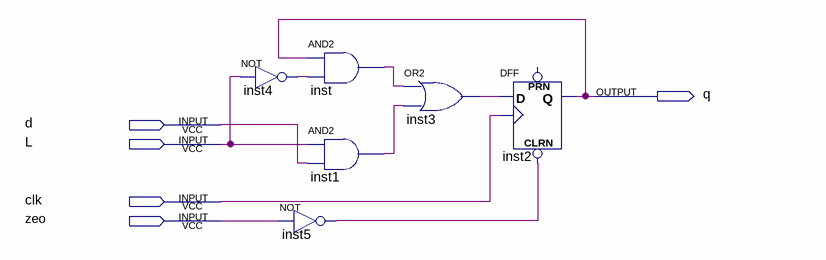
[diagram p0: schematic sheet]
// Quartus schematic da0.bdf as structural Verilog: 6 symbols, 5 pins
module da0 (
  input  d,
  input  L,
  input  clk,
  input  zeo,
  output q
);

  wire inst1_out, inst3_out, inst4_out, inst5_out, inst_out;

  not inst4 (inst4_out, L);
  and inst (inst_out, q, inst4_out);
  and inst1 (inst1_out, L, d);
  not inst5 (inst5_out, zeo);
  or inst3 (inst3_out, inst_out, inst1_out);
  DFF inst2 (.CLRN(inst5_out), .CLK(clk), .D(inst3_out), .Q(q));  // open: PRN
endmodule
